# Altium schematic sheet RealTimeClock.SchDoc
size A; SheetNumber: 2; SheetTotal: 6; SPICEModelCacheFCKXXZSW: <root> / <DocumentId>FCKXXZSW</DocumentId> / <CacheFrame Number="0"> / <Model Name="cap" Kind="MDL"> / <Text>*Default semiconductor capacitor / .MODEL CAP C()</Text> / </Model> / </CacheFrame> / </root>
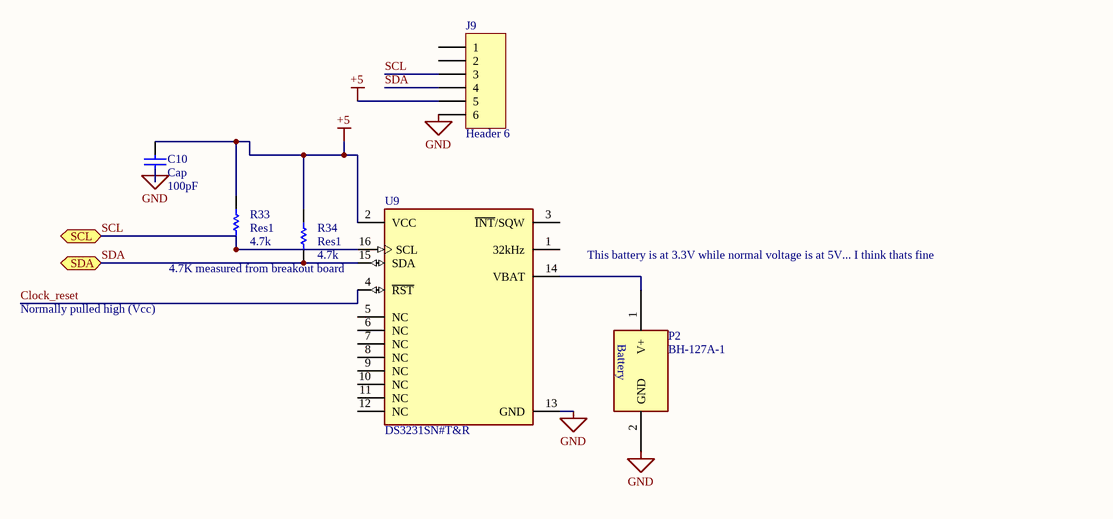
[diagram p0: RealTimeClock.SchDoc]

## Parts
C10  Cap  value 100pF  [0603]
J9  Header 6  [HDR1X6]
P2  BH-127A-1  [banana]
R33  Res1  value 4.7k  [0603]
R34  Res1  value 4.7k  [0603]
U9  DS3231SN#T&R  [FP-W16-H2-MFG]

## Ports
SCL (bidir), SDA (bidir)

## Nets
+5: C10.2 J9.5 R33.2 R34.2 U9.2(VCC)
GND: C10.1 J9.6 P2.2(GND) U9.13(GND)
Clock_reset: U9.4(~{RST})
SCL: J9.3 R33.1 U9.16(SCL) ; port SCL
SDA: J9.4 R34.1 U9.15(SDA) ; port SDA
NetP2_1: P2.1(V+) U9.14(VBAT)

Not connected (* = marked no-connect by the designer): J9 1 2; U9 1(32kHz) 3(~{INT}/SQW) 5(NC) 6(NC) 7(NC) 8(NC) 9(NC) 10(NC) 11(NC) 12(NC)

## Notes on the sheet
- 4.7K measured from breakout board
- This battery is at 3.3V while normal voltage is at 5V... I think thats fine
- Normally pulled high (Vcc)
- (in symbol BH-127A-1) Battery

## Library data of the parts
C10 = Cap: Capacitor; Published: 8-Jun-2000; LatestRevisionDate: 17-Jul-2002; LatestRevisionNote: Re-released for DXP Platform.; PackageReference: RAD-0.3; Publisher: Altium Limited; PackageDescription: Radial Cap, Thru-Hole; 2 Leads; 0.3 in Pin Spacing
J9 = Header 6: Header, 6-Pin; LatestRevisionDate: 17-Jul-2002; LatestRevisionNote: Re-released for DXP Platform.; Publisher: Altium Limited
R33 R34 = Res1: Resistor; Published: 8-Jun-2000; LatestRevisionDate: 17-Jul-2002; LatestRevisionNote: Re-released for DXP Platform.; PackageReference: AXIAL-0.3; Publisher: Altium Limited; PackageDescription: Axial Device, Thru-Hole; 2 Leads; 0.3 in Pin Spacing
U9 = CMP-0254-00375-2: IC RTC CLK/CALENDAR I2C 16-SOIC; Operating Supply Voltage: 3.3V; Max Supply Voltage: 5.5V; Logic Function: Clock; Time Format: HH:MM:SS; Date Format: YY-MM-DD-dd; Min Supply Voltage: 2.3V; Min Operating Temperature: -40°C; Packaging: Tape and Reel; Radiation Hardening: No; Package Quantity: 1000; Case/Package: SOIC; Max Operating Temperature: 85°C; Lead Free: Lead Free; Interface: I2C; Contact Plating: Tin; Number of Pins: 16; Mount: Surface Mount